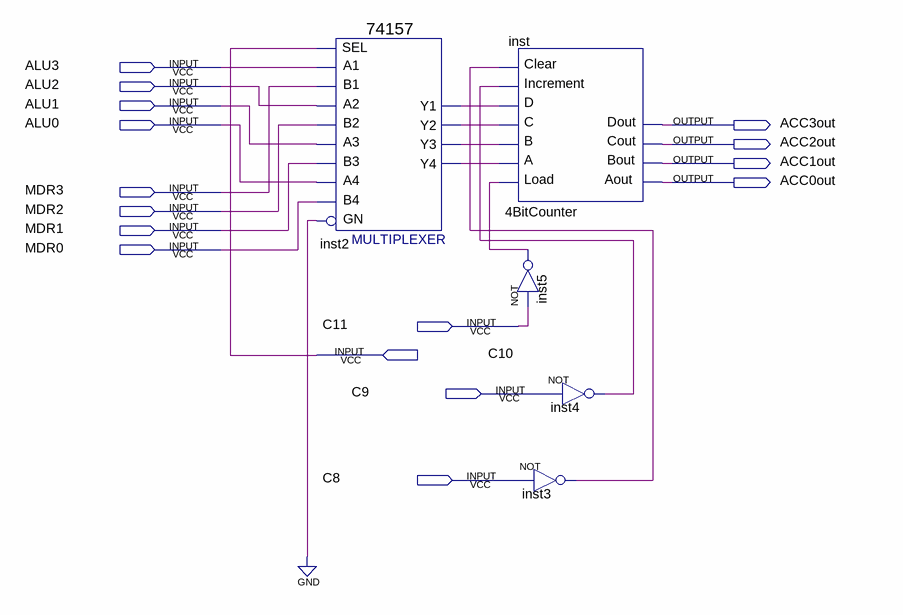
[diagram p0: schematic sheet]
// Quartus schematic ACC.bdf as structural Verilog: 5 symbols, 16 pins
module ACC (
  input  ALU3,
  input  ALU2,
  input  ALU1,
  input  ALU0,
  input  MDR3,
  input  MDR2,
  input  MDR1,
  input  MDR0,
  input  C11,
  input  C10,
  input  C9,
  input  C8,
  output ACC3out,
  output ACC2out,
  output ACC1out,
  output ACC0out
);

  wire inst2_y1, inst2_y2, inst2_y3, inst2_y4, inst3_out, inst4_out, inst5_out;

  \74157  inst2 (
    .A1(ALU3), .B1(MDR3), .SEL(C10), .B2(MDR2), .A3(ALU1), .B3(MDR1), .A2(ALU2), .B4(MDR0), .GN(1'b0),
    .A4(ALU0), .Y2(inst2_y2), .Y1(inst2_y1), .Y4(inst2_y4), .Y3(inst2_y3));
  \4BitCounter  inst (
    .Load(inst5_out), .A(inst2_y4), .B(inst2_y3), .C(inst2_y2), .D(inst2_y1), .Increment(inst4_out),
    .Clear(inst3_out), .Aout(ACC0out), .Bout(ACC1out), .Cout(ACC2out), .Dout(ACC3out));
  not inst5 (inst5_out, C11);
  not inst4 (inst4_out, C9);
  not inst3 (inst3_out, C8);
endmodule
